# Altium schematic sheet Power.SchDoc
size A; SheetNumber: 2; SheetTotal: 2
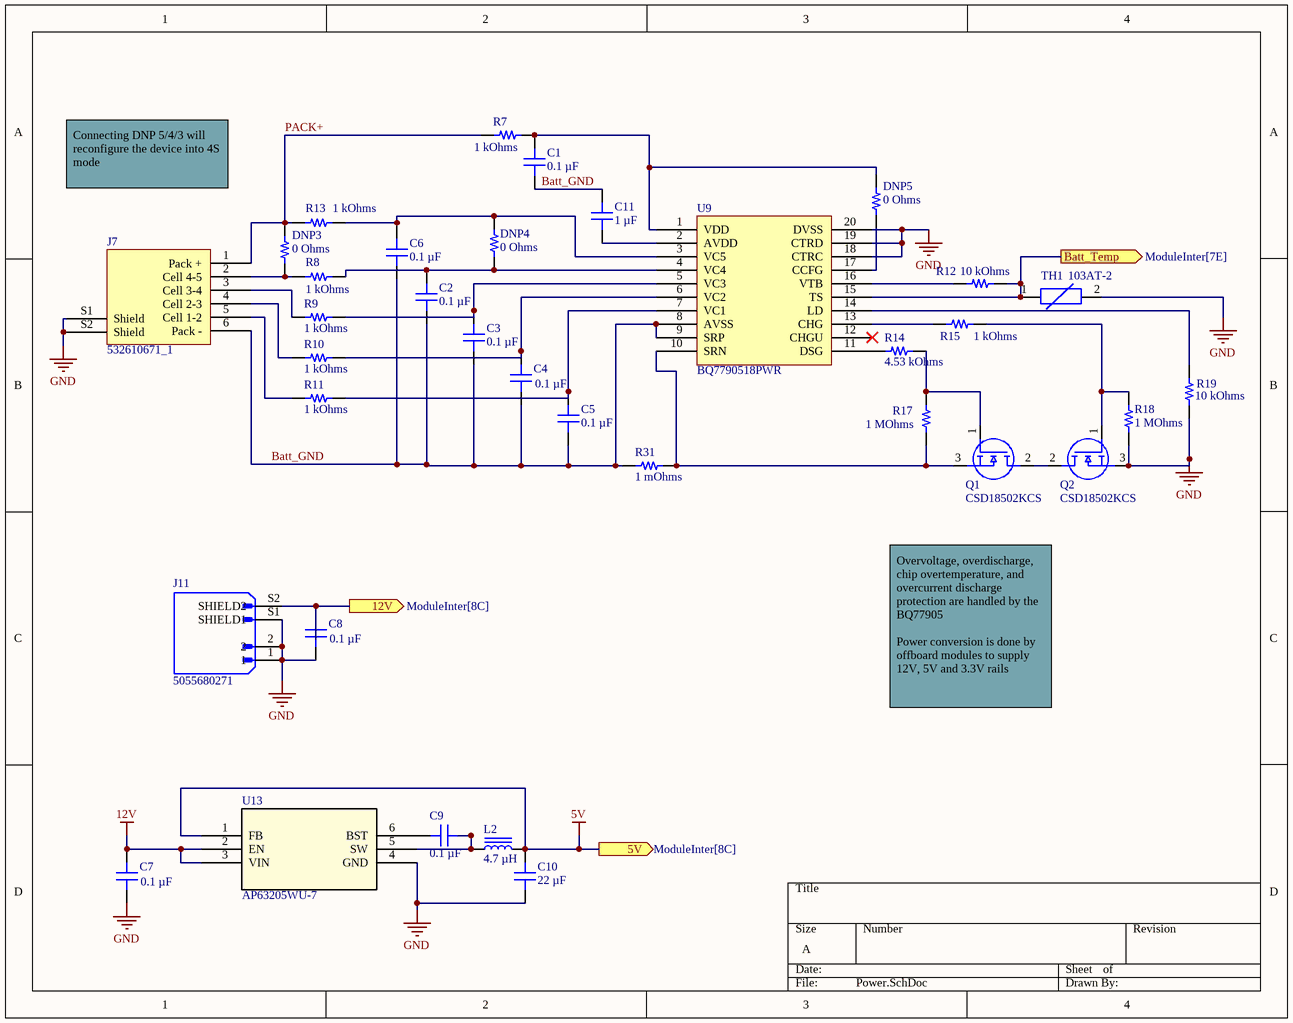
[diagram p0: Power.SchDoc]

## Parts
C1  0.1 µF  [CAP 1206_3216 - 0.8MM]
C2  0.1 µF  [CAP 1206_3216 - 0.8MM]
C3  0.1 µF  [CAP 1206_3216 - 0.8MM]
C4  0.1 µF  [CAP 1206_3216 - 0.8MM]
C5  0.1 µF  [CAP 1206_3216 - 0.8MM]
C6  0.1 µF  [CAP 1206_3216 - 0.8MM]
C7  0.1 µF  [CAP 1206_3216 - 0.8MM]
C8  0.1 µF  [CAP 1206_3216 - 0.8MM]
C9  0.1 µF  [CAP 1206_3216 - 0.8MM]
C10  22 µF  [CAP 0805_2012]
C11  1 µF  [CAP 0805_2012]
DNP3  0 Ohms  [RES 1206_3216]
DNP4  0 Ohms  [RES 1206_3216]
DNP5  0 Ohms  [RES 1206_3216]
J7  532610671_1  [MOLEX_532610671]
J11  5055680271  [MOLEX_5055680271]
L2  4.7 µH  [BOURNS SRP5030T]
Q1  CSD18502KCS  [TO254P470X1016X2005-3P]
Q2  CSD18502KCS  [TO254P470X1016X2005-3P]
R7  1 kOhms  [RES 1206_3216]
R8  1 kOhms  [RES 1206_3216]
R9  1 kOhms  [RES 1206_3216]
R10  1 kOhms  [RES 1206_3216]
R11  1 kOhms  [RES 1206_3216]
R12  10 kOhms  [RES 1206_3216]
R13  1 kOhms  [RES 1206_3216]
R14  4.53 kOhms  [RES 1206_3216]
R15  1 kOhms  [RES 0805_2012]
R17  1 MOhms  [RES 1206_3216]
R18  1 MOhms  [RES 1206_3216]
R19  10 kOhms  [RES 1206_3216]
R31  1 mOhms  [RES 0805_2012]
TH1  103AT-2  [103At-2]
U9  BQ7790518PWR  [SOP65P640X120-20N]
U13  AP63205WU-7  [SOIC_05WU-7_DIO]

## Ports
5V (out, see ModuleInter[8C]), 12V (out, see ModuleInter[8C]), Batt_Temp (out, see ModuleInter[7E])

## Nets
5V: C10.2 L2.2 U13.1(FB) ; port 5V
12V: C7.2 U13.2(EN) U13.3(VIN)
GND: C7.1 C8.1 C10.1 J7.S1(Shield) J7.S2(Shield) J11.1 J11.2 J11.S1(SHIELD1) Q2.3(S) R18.1 R19.1 TH1.2 U9.18(CTRC) U9.19(CTRD) U9.20(DVSS) U13.4(GND)
12V: C8.2 J11.S2(SHIELD2) ; port 12V  [a separate net that carries the same name]
Batt_GND: C1.1 C2.1 C3.1 C4.1 C5.1 C6.1 C11.2 J7.6(Pack_-) R31.1 U9.8(AVSS) U9.9(SRP)
Batt_Temp: R12.1 TH1.1 U9.15(TS) ; port Batt_Temp
PACK+: DNP3.2 J7.1(Pack_+) R7.1 R13.1
NetC1_2: C1.2 DNP5.2 R7.2 U9.1(VDD)
NetC2_2: C2.2 DNP4.1 R8.2 U9.4(VC4)
NetC3_2: C3.2 R9.2 U9.5(VC3)
NetC4_2: C4.2 R10.2 U9.6(VC2)
NetC5_2: C5.2 R11.2 U9.7(VC1)
NetC6_2: C6.2 DNP4.2 R13.2 U9.3(VC5)
NetC9_1: C9.1 L2.1 U13.5(SW)
NetC9_2: C9.2 U13.6(BST)
NetC11_1: C11.1 U9.2(AVDD)
NetDNP3_1: DNP3.1 J7.2(Cell_4-5) R8.1
NetDNP5_1: DNP5.1 U9.17(CCFG)
NetJ7_3: J7.3(Cell_3-4) R9.1
NetJ7_4: J7.4(Cell_2-3) R10.1
NetJ7_5: J7.5(Cell_1-2) R11.1
NetQ1_1: Q1.1(G) R14.2 R17.1
NetQ1_2: Q1.2(D) Q2.2(D)
NetQ1_3: Q1.3(S) R17.2 R31.2 U9.10(SRN)
NetQ2_1: Q2.1(G) R15.2 R18.2
NetR12_2: R12.2 U9.16(VTB)
NetR14_1: R14.1 U9.11(DSG)
NetR15_1: R15.1 U9.13(CHG)
NetR19_2: R19.2 U9.14(LD)

Not connected (* = marked no-connect by the designer): U9 12(CHGU)*

## Notes on the sheet
- Connecting DNP 5/4/3 will  reconfigure the device into 4S mode
- Text
- Overvoltage, overdischarge, chip overtemperature, and overcurrent discharge protection are handled by the BQ77905
  Power conversion is done by offboard modules to supply 12V, 5V and 3.3V rails

## Library data of the parts
C1-C9 = CC1206MRY5V9BB104: CAP CER 0.1UF 50V Y5V 1206; manufacturer: Yageo; Temperature Coefficient: Y5V (F); Tolerance: ±20%; Part Number: CC1206MRY5V9BB104; Value: 0.1 µF; Applications: General Purpose; Capacitance: 0.1 µF; componentlink1description: Datasheet; componentlink1url: http://www.yageo.com/documents/recent/UPY-GPHC_Y5V_6.3V-to-50V_8.pdf; componentlink2description: DigiKey Link; componentlink2url: https://www.digikey.com/en/products/detail/yageo/CC1206MRY5V9BB104/5884674; Device Package: 1206 (3216 Metric); lastupdated: 3/20/2023 7:15:05 PM; Lifecycle Status: Active; Minimum Order: 1; Mounting Type: Surface Mount, MLCC; Operating Temperature: -30°C ~ 85°C; Package / Case: 1206 (3216 Metric); packaging: TapeAndReel; partid: 18711; Part Status: Active; price: 0.05; series: CC; Size / Dimension: 0.126" L x 0.063" W (3.20mm x 1.60mm); Supplier 1: DigiKey; Supplier Part Number 1: 311-4504-1-ND; Thickness (Max): 0.028" (0.70mm); Voltage - Rated: 50V
C10 = CL21A226KOQNNNG: CAP CER 22UF 16V X5R 0805; manufacturer: Samsung Electro-Mechanics; Tolerance: ±10%; Part Number: CL21A226KOQNNNG; Value: 22 µF; Applications: General Purpose; Capacitance: 22 µF; componentlink1description: Datasheet; componentlink1url: //media.digikey.com/pdf/Data%20Sheets/Samsung%20PDFs/CL21A226KOQNNNG_Spec.pdf; componentlink2description: DigiKey Link; componentlink2url: https://www.digikey.com/en/products/detail/samsung-electro-mechanics/CL21A226KOQNNNG/3894433; Device Package: 0805 (2012 Metric); lastupdated: 3/20/2023 7:12:43 PM; Lifecycle Status: Active; Minimum Order: 1; Mounting Type: Surface Mount, MLCC; Operating Temperature: -55°C ~ 85°C; Package / Case: 0805 (2012 Metric); packaging: TapeAndReel; partid: 3000; Part Status: Active; price: 0.06; series: CL; Size / Dimension: 0.079" L x 0.049" W (2.00mm x 1.25mm); Supplier 1: DigiKey; Supplier Part Number 1: 1276-7092-1-ND; Temperature Coefficient: X5R; Thickness (Max): 0.055" (1.40mm); Voltage - Rated: 16V
C11 = GCJ21BR71H105KA01L: CAP CER 1UF 50V X7R 0805; manufacturer: Murata Electronics; Tolerance: ±10%; Part Number: GCJ21BR71H105KA01L; Value: 1 µF; Applications: Automotive, Boardflex Sensitive; Capacitance: 1 µF; componentlink1description: Datasheet; componentlink1url: https://www.murata.com/~/media/webrenewal/support/library/catalog/products/capacitor/mlcc/c03e.ashx?la=en-us; componentlink2description: DigiKey Link; componentlink2url: https://www.digikey.com/en/products/detail/murata-electronics/GCJ21BR71H105KA01L/4903512; Device Package: 0805 (2012 Metric); Features: Soft Termination; lastupdated: 3/20/2023 7:12:43 PM; Lifecycle Status: Active; Minimum Order: 1; Mounting Type: Surface Mount, MLCC; Operating Temperature: -55°C ~ 125°C; Package / Case: 0805 (2012 Metric); packaging: TapeAndReel; partid: 2709; Part Status: Active; price: 0.05; Ratings: AEC-Q200; series: GCJ; Size / Dimension: 0.079" L x 0.049" W (2.00mm x 1.25mm); Supplier 1: DigiKey; Supplier Part Number 1: 490-10667-1-ND; Temperature Coefficient: X7R; Thickness (Max): 0.057" (1.45mm); Voltage - Rated: 50V
DNP3-DNP5 = RC1206JR-7W0RL: RES 0 OHM JUMPER 1/2W 1206; Manufacturer: Yageo; Power (Watts): 0.5W, 1/2W; Part Number: RC1206JR-7W0RL; ComponentLink1Description: Datasheet; ComponentLink1URL: https://www.yageo.com/upload/media/product/productsearch/datasheet/rchip/PYu-RC_Group_51_RoHS_L_11.pdf; ComponentLink2Description: DigiKey Link; ComponentLink2URL: https://www.digikey.com/en/products/detail/yageo/RC1206JR-7W0RL/12698846; Composition: Thick Film; Device Package: 1206 (3216 Metric); Features: Moisture Resistant; Height - Seated (Max): 0.026" (0.65mm); LastUpdated: 3/20/2023 7:35:33 PM; Lifecycle Status: Active; Minimum Order: 1; Number of Terminations: 2; Operating Temperature: -55°C ~ 155°C; Package / Case: 1206 (3216 Metric); Packaging: TapeAndReel; PartId: 66997; Part Status: Active; Price: 0.01; Resistance: 0 Ohms; Series: RC_L; Size / Dimension: 0.122" L x 0.063" W (3.10mm x 1.60mm); Supplier 1: DigiKey; Supplier Part Number 1: 13-RC1206JR-7W0RLCT-ND; Supplier Device Package: 1206; Tolerance: Jumper; Value: 0 Ohms
J7 = 532610671_1: Conn Shrouded Header (4 Sides) HDR 6 POS 1.25mm Solder RA Side Entry SMD PicoBlade™ T/R
J11 = 5055680271: 1.25mm Pitch, Micro-Lock Plus PCB Header, Single Row, Vertical, Surface Mount, Tin-Bismuth Plating, Positive Lock, 2 Circuits, with Pick-and-Place Polyimide Tape, Black; MF: Molex; Availability: In Stock; Price: None; Purchase-URL: https://pricing.snapeda.com/search/part/5055680271/?ref=eda; Package: None; SnapEDA_Link: https://www.snapeda.com/parts/5055680271/Molex/view-part/?ref=snap; MP: 5055680271; Value: *; Check_prices: https://www.snapeda.com/parts/5055680271/Molex/view-part/?ref=eda
L2 = SRP5030T-4R7M: FIXED IND 4.7UH 4.6A 53 MOHM SMD; Manufacturer: Bourns Inc.; Current - Saturation: 6A; DC Resistance (DCR): 53mOhm Max; Inductance Frequency - Test: 100 kHz; Material - Core: Iron Powder; Shielding: Shielded; Tolerance: ±20%; Type: Drum Core, Wirewound; Part Number: SRP5030T-4R7M; ComponentLink1Description: Datasheet; ComponentLink1URL: https://www.bourns.com/docs/Product-Datasheets/SRP5030T.pdf; ComponentLink2Description: DigiKey Link; ComponentLink2URL: https://www.digikey.com/en/products/detail/bourns-inc/SRP5030T-4R7M/3986084; Current Rating (Amps): 4.6 A; Device Package: Nonstandard; Height - Seated (Max): 0.118" (3.00mm); Inductance: 4.7 µH; LastUpdated: 3/20/2023 8:00:56 PM; Lifecycle Status: Active; Minimum Order: 1; Mounting Type: Surface Mount; Operating Temperature: -40°C ~ 125°C; Package / Case: Nonstandard; Packaging: TapeAndReel; PartId: 1; Part Status: Active; Price: 0.61; Series: SRP5030T; Size / Dimension: 0.224" L x 0.205" W (5.70mm x 5.20mm); Supplier 1: DigiKey; Supplier Part Number 1: SRP5030T-4R7MCT-ND; Value: 4.7 µH
Q1 Q2 = CSD18502KCS: 40V, N ch NexFET MOSFET, single TO-220, 2.9mOhm; Manufacturer_Name: Texas Instruments; Geometry.Height: 4.7mm; Mouser Part Number: 595-CSD18502KCS; Mouser Price/Stock: https://www.mouser.co.uk/ProductDetail/Texas-Instruments/CSD18502KCS?qs=vnbNJPHmPnMgIZsUWlws9A%3D%3D; Manufacturer_Part_Number: CSD18502KCS; Datasheet Link: http://www.ti.com/lit/gpn/csd18502kcs
R7-R11 R13 = RNCS1206BKE1K00: RES 1K OHM 0.1% 1/8W 1206; Manufacturer: Stackpole Electronics Inc; Power (Watts): 0.125W, 1/8W; Temperature Coefficient: ±25ppm/°C; Part Number: RNCS1206BKE1K00; ComponentLink1Description: Datasheet; ComponentLink1URL: https://www.seielect.com/catalog/sei-rncs_rnch.pdf; ComponentLink2Description: DigiKey Link; ComponentLink2URL: https://www.digikey.com/en/products/detail/stackpole-electronics-inc/RNCS1206BKE1K00/1800333; Composition: Thin Film; Device Package: 1206 (3216 Metric); Features: Anti-Corrosive, Automotive AEC-Q200, Moisture Resistant; Height - Seated (Max): 0.026" (0.65mm); LastUpdated: 3/20/2023 7:37:22 PM; Lifecycle Status: Active; Minimum Order: 1; Number of Terminations: 2; Operating Temperature: -55°C ~ 155°C; Package / Case: 1206 (3216 Metric); Packaging: TapeAndReel; PartId: 26856; Part Status: Active; Price: 0.09; Ratings: AEC-Q200; Resistance: 1 kOhms; Series: RNCS; Size / Dimension: 0.120" L x 0.061" W (3.05mm x 1.55mm); Supplier 1: DigiKey; Supplier Part Number 1: RNCS1206BKE1K00CT-ND; Supplier Device Package: 1206; Tolerance: ±0.1%; Value: 1 kOhms
R12 R19 = CRG1206F10K: RES SMD 10K OHM 1% 1/4W 1206; Manufacturer: TE Connectivity Passive Product; Power (Watts): 0.25W, 1/4W; Temperature Coefficient: ±100ppm/°C; Part Number: CRG1206F10K; ComponentLink1Description: Datasheet; ComponentLink1URL: https://www.te.com/commerce/DocumentDelivery/DDEController?Action=srchrtrv&DocNm=1773204&DocType=DS&DocLang=English; ComponentLink2Description: DigiKey Link; ComponentLink2URL: https://www.digikey.com/en/products/detail/te-connectivity-passive-product/CRG1206F10K/2389909; Composition: Thick Film; Device Package: 1206 (3216 Metric); Height - Seated (Max): 0.026" (0.65mm); LastUpdated: 3/20/2023 7:37:21 PM; Lifecycle Status: Active; Minimum Order: 1; Number of Terminations: 2; Operating Temperature: -55°C ~ 155°C; Package / Case: 1206 (3216 Metric); Packaging: TapeAndReel; PartId: 26989; Part Status: Active; Price: 0.01; Resistance: 10 kOhms; Series: CRG, Neohm; Size / Dimension: 0.122" L x 0.061" W (3.10mm x 1.55mm); Supplier 1: DigiKey; Supplier Part Number 1: A106069CT-ND; Supplier Device Package: 1206; Tolerance: ±1%; Value: 10 kOhms
R14 = RNCP1206FTD4K53: RES 4.53K OHM 1% 1/2W 1206; Manufacturer: Stackpole Electronics Inc; Power (Watts): 0.5W, 1/2W; Temperature Coefficient: ±100ppm/°C; Part Number: RNCP1206FTD4K53; ComponentLink1Description: Datasheet; ComponentLink1URL: https://www.seielect.com/catalog/sei-rncp.pdf; ComponentLink2Description: DigiKey Link; ComponentLink2URL: https://www.digikey.com/en/products/detail/stackpole-electronics-inc/RNCP1206FTD4K53/2240357; Composition: Thin Film; Device Package: 1206 (3216 Metric); Features: Anti-Sulfur; Height - Seated (Max): 0.025" (0.65mm); LastUpdated: 3/20/2023 7:37:08 PM; Lifecycle Status: Active; Minimum Order: 1; Number of Terminations: 2; Operating Temperature: -55°C ~ 155°C; Package / Case: 1206 (3216 Metric); Packaging: TapeAndReel; PartId: 29215; Part Status: Active; Price: 0.01; Resistance: 4.53 kOhms; Series: RNCP; Size / Dimension: 0.122" L x 0.059" W (3.10mm x 1.50mm); Supplier 1: DigiKey; Supplier Part Number 1: RNCP1206FTD4K53CT-ND; Supplier Device Package: 1206; Tolerance: ±1%; Value: 4.53 kOhms
R15 = SR0805JR-7W1KL: RES 1K OHM 5% 1/4W 0805; Manufacturer: Yageo; Power (Watts): 0.25W, 1/4W; Temperature Coefficient: ±100ppm/°C; Part Number: SR0805JR-7W1KL; Value: 1 kOhms; ComponentLink1Description: Datasheet; ComponentLink1URL: http://www.yageo.com/documents/recent/PYu-SR_20105_RoHS_L_8.pdf; ComponentLink2Description: DigiKey Link; ComponentLink2URL: https://www.digikey.com/en/products/detail/yageo/SR0805JR-7W1KL/9696409; Composition: Thick Film; Device Package: 0805 (2012 Metric); Features: Automotive AEC-Q200, Pulse Withstanding; Height - Seated (Max): 0.024" (0.60mm); LastUpdated: 3/20/2023 7:43:37 PM; Lifecycle Status: Active; Minimum Order: 1; Number of Terminations: 2; Operating Temperature: -55°C ~ 155°C; Package / Case: 0805 (2012 Metric); Packaging: TapeAndReel; PartId: 30716; Part Status: Active; Price: 0.03; Ratings: AEC-Q200; Resistance: 1 kOhms; Series: SR; Size / Dimension: 0.079" L x 0.049" W (2.00mm x 1.25mm); Supplier 1: DigiKey; Supplier Part Number 1: YAG6171CT-ND; Supplier Device Package: 0805; Tolerance: ±5%
R17 R18 = MCA1206MD1004BP100: MCA 1206-25 0.1% AT P1 1M0; Manufacturer: Vishay Beyschlag; Power (Watts): 0.4W, 2/5W; Temperature Coefficient: ±25ppm/°C; Part Number: MCA1206MD1004BP100; ComponentLink2Description: DigiKey Link; ComponentLink2URL: http://digikey.com/product-detail/en/vishay-beyschlag/MCA1206MD1004BP100/749-MCA1206MD1004BP100CT-ND/11196621; Composition: Thin Film; Device Package: 1206 (3216 Metric); Features: Anti-Sulfur, Automotive AEC-Q200; LastUpdated: 3/20/2023 7:35:50 PM; Lifecycle Status: Active; Minimum Order: 1; Number of Terminations: 2; Operating Temperature: -55°C ~ 155°C; Package / Case: 1206 (3216 Metric); Packaging: TapeAndReel; PartId: 50044; Part Status: Active; Price: 0.38; Ratings: AEC-Q200; Resistance: 1 MOhms; Series: MCA AT - Precision; Supplier 1: DigiKey; Supplier Part Number 1: 749-MCA1206MD1004BP100CT-ND; Supplier Device Package: 1206; Tolerance: ±0.1%; Value: 1 MOhms
R31 = CSS0508FT1L00: RES 0.001 OHM 1W 1% 0508 SMD; Manufacturer: Stackpole Electronics Inc; Temperature Coefficient: ±150ppm/°C; Part Number: CSS0508FT1L00; Value: 1 mOhms; ComponentLink1Description: Datasheet; ComponentLink1URL: https://www.seielect.com/catalog/sei-css_cssh.pdf; ComponentLink2Description: DigiKey Link; ComponentLink2URL: https://www.digikey.com/en/products/detail/stackpole-electronics-inc/CSS0508FT1L00/10329022; Composition: Metal Element; Device Package: 0805 (2012 Metric); Features: Automotive AEC-Q200, Current Sense; Height - Seated (Max): 0.017" (0.42mm); LastUpdated: 3/20/2023 7:42:55 PM; Lifecycle Status: Active; Minimum Order: 1; Number of Terminations: 2; Operating Temperature: -55°C ~ 155°C; Package / Case: 0805 (2012 Metric); Packaging: TapeAndReel; PartId: 66673; Part Status: Active; Power (Watts): 1W; Price: 0.11; Ratings: AEC-Q200; Resistance: 1 mOhms; Series: CSS; Size / Dimension: 0.049" L x 0.079" W (1.25mm x 2.00mm); Supplier 1: DigiKey; Supplier Part Number 1: CSS0508FT1L00CT-ND; Supplier Device Package: 0508; Tolerance: ±1%
TH1 = 103AT-2: NTC Thermistors 10kohm 1%
U13 = AP63205WU-7: No Description Available; Mfr_Name: Diodes Inc; Copyright: Copyright (C) 2023 Ultra Librarian. All rights reserved.; Manufacturer_Part_Number: AP63205WU-7; Digi-Key_Part_Number_1: AP63205WU-7DITR-ND; Digi-Key_Part_Number_2: AP63205WU-7DICT-ND; Digi-Key_Part_Number_3: AP63205WU-7DIDKR-ND; RefDes: RefDes; Type: DEV